# EAGLE design neojoint-splitter (EAGLE 6.6.0)
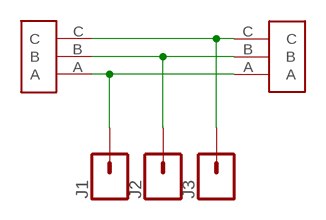
[diagram p0: schematic, sheet 1]

## Parts
J1  CONN_01  [1X01]
J2  CONN_01  [1X01]
J3  CONN_01  [1X01]
U$1  LED_STRIP_3P  [LEDSTRIP-3P]
U$2  LED_STRIP_3P  [LEDSTRIP-3P]

## Nets
N$1: J1.1 U$1.A U$2.A
N$2: J2.1 U$1.B U$2.B
N$3: J3.1 U$1.C U$2.C

## Library data of the parts
J1-J3 = SparkFun-Connectors:CONN_01: Single connection point. Often used as Generic Header-pin footprint for 0.1 inch spaced/style header connections On any of the 0.1 inch spaced packages, you can populate with these: Break Away Headers - Straight <https://www.sparkfun.com/products/116> (PRT-00116) Break Away Male Headers - Right Angle <https://www.sparkfun.com/products/553> (PRT-00553) Female Headers <https://www.sparkfun.com/products/115> (PRT-00115) Break Away Headers - Machine Pin <https://www.sparkfun.com/products/117> (PRT-00117) Break Away Female Headers - Swiss Machine Pin <https://www.sparkfun.com/products/743> (PRT-00743) This device is also useful as a general connection point to wire up your design to another part of your project. Our various solder wires solder well into these plated through hole pads. Hook-Up Wire - Assortment (Stranded, 22 AWG) <https://www.sparkfun.com/products/11375> (PRT-11375) Hook-Up Wire - Assortment (Solid Core, 22 AWG) <https://www.sparkfun.com/products/11367> (PRT-11367) View the entire wire category on our website here <https://www.sparkfun.com/categories/141> Special notes: SMTSO-256-ET is a "flush mount" nut for a 4-40 screw. We mostly use this on specialty testbeds; it is a nice way to connect hardware to your PCB at an adjustable hieght. Also note, the SNAP packages are for using a snappable style connector. We sell a baggie of snaps and they are also used on two LilyPad designs: Snap Assortment - 30 pack (male and female) <https://www.sparkfun.com/products/11347> (DEV-11347) LilyPad Arduino SimpleSnap <https://www.sparkfun.com/products/10941> (DEV-10941) LilyPad SimpleSnap Protoboard <https://www.sparkfun.com/products/10940> (DEV-10940)
U$1 U$2 = NeoJoints:LED_STRIP_3P: NeoJoint pads for WS2812 / NeoPixel LED strips

## Board
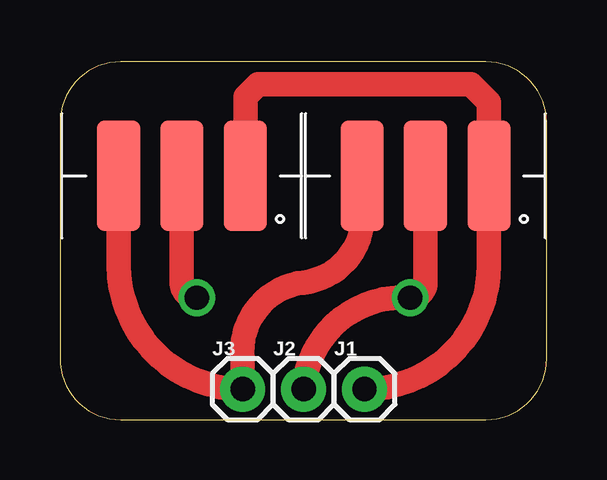
[diagram p1: board, top side]
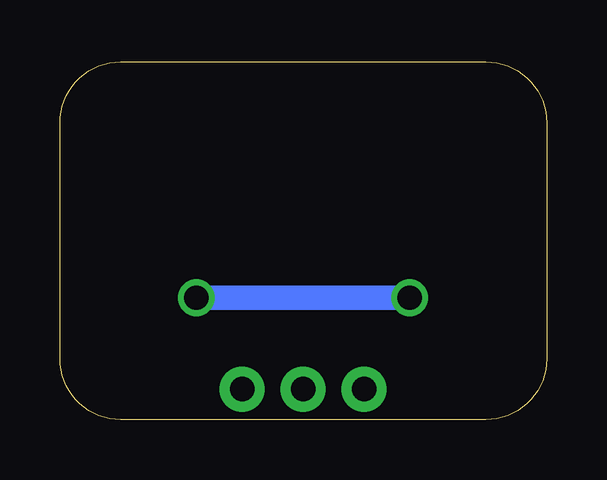
[diagram p2: board, bottom side, seen from below]

Size 20.3 x 14.91 mm. Coordinates in mm from the lower left corner, seen from the top.
Outline: 0,12.37 0,2.54 arc90 2.54,0 17.76,0 arc90 20.3,2.54 20.3,12.37 arc90 17.76,14.91 2.54,14.91 arc90 0,12.37
Copper layers (1*16): Top 0.035mm / dielectric 1.5mm / Bottom 0.035mm
Design rules "OthermillDRC_30_deg_v2": minimum track width 6mil, minimum drill 0.8mm, track to track 6mil, track to pad 6mil, pad to pad 6mil, via to via 6mil, smd to smd 0mil, copper to edge 0mil, drill to drill 6mil, minimum pad ring 10mil, minimum via ring 10mil, stop-mask expansion 1mil, vias tented up to drill 30mil, thermal gap 6mil

### Footprints (pad centres in the part's own frame; a part is rotated, then mirrored left to right if it is on the bottom)
1X01 = drill 1.016 pad 1.88: 1 0,0
LEDSTRIP-3P = smd 4.6 x 1.8: A 0,-2.65; B 0,0; C 0,2.63

### Placement (x,y rotation side)
J1  12.7,1.27 0 top
J2  10.16,1.27 0 top
J3  7.62,1.27 0 top
U$1  5.08,10.16 90 top
U$2  15.24,10.16 90 top

### Tracks (layer width: path | path; a pad name or v marks a point on that pad's centre or on a via)
N$1
  Top 1.016: U$1.A 7.73,13.45 8.26,13.97 10.16,13.97 17.14,13.97 17.89,13.23 U$2.A 17.89,6.46 arc-90 J1.1
N$2  (via drill 1.02)
  Top 1.016: U$2.B 15.24,7.62 15.24,6.99 15.24,5.71 arc-90 v14.61,5.08 arc90 J2.1 | U$1.B 5.08,6.35 5.08,5.71 arc90 v5.71,5.08
  Bottom 1.016: v5.71,5.08 10.79,5.08 v14.61,5.08
N$3
  Top 1.016: U$1.C 2.45,6.44 arc90 J3.1 7.62,2.54 arc-90 10.16,5.71 arc90 12.61,8.8 U$2.C